# EAGLE design tv_b_gone_extended_schematic (EAGLE 8.5.0)
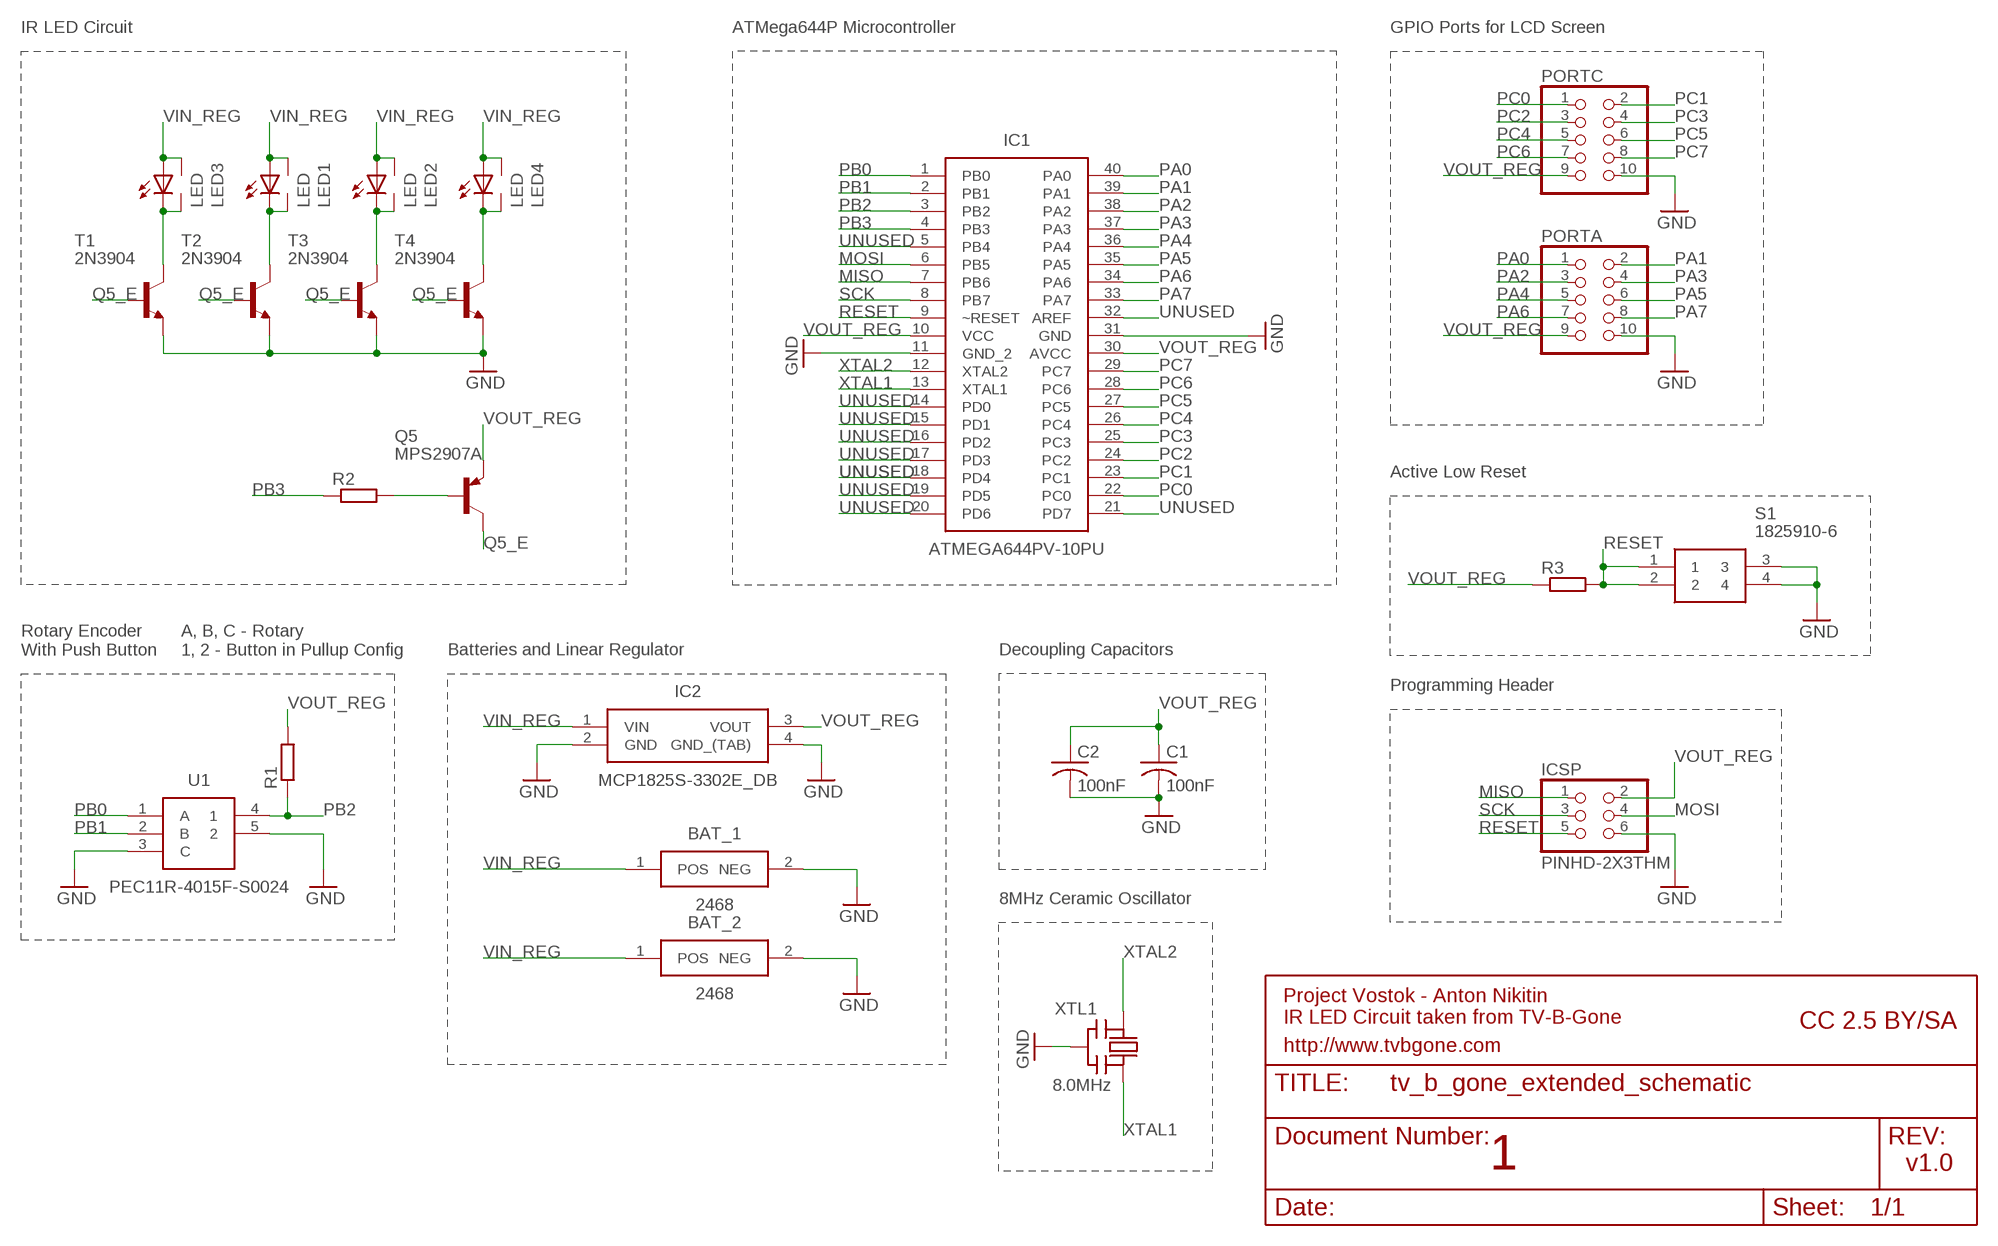
[diagram p0: schematic, sheet 1]

## Parts
BAT_1  2468  [2468]
BAT_2  2468  [2468]
C1  100nF  C-US025-025X050  [C025-025X050]
C2  100nF  C-US025-025X050  [C025-025X050]
IC1  ATMEGA644PV-10PU  [DIP254P1524X483-40]
IC2  MCP1825S-3302E_DB  [SOT230P700X180-4N]
ICSP  PINHD-2X3THM  [ISP6]
LED1  LED  [5MM-SIDE]
LED2  LED  [5MM-SIDE]
LED3  LED  [5MM-SIDE]
LED4  LED  [5MM-SIDE]
PORTA  PINHD-2X5  [2X05]
PORTC  PINHD-2X5  [2X05]
Q5  MPS2907A  [TO92-CBE]
R1  R-EU_0204/5  [0204/5]
R2  R-EU_0204/5  [0204/5]
R3  R-EU_0204/7  [0204/7]
S1  1825910-6  [1825910-6]
T1  2N3904  [TO92]
T2  2N3904  [TO92]
T3  2N3904  [TO92]
T4  2N3904  [TO92]
U1  PEC11R-4015F-S0024  [PEC12R-4XXXF-SXXXX_1]
XTL1  8.0MHz  CERMOSCILL  [CERM_OSC]

## Nets
GND: BAT_1.2(NEG) BAT_2.2(NEG) C1.2 C2.2 IC1.11(GND_2) IC1.31(GND) IC2.2(GND) IC2.4(GND_(TAB)) ICSP.6 PORTA.10 PORTC.10 S1.3 S1.4 T1.3(E) T2.3(E) T3.3(E) T4.3(E) U1.3(C) U1.5 XTL1.P$2(GND)
MISO: IC1.7(PB6) ICSP.1
MOSI: IC1.6(PB5) ICSP.4
N$7: Q5.B R2.2
N$10: IC1.5(PB4)
N$11: IC1.14(PD0)
N$12: IC1.15(PD1)
N$13: IC1.16(PD2)
N$14: IC1.17(PD3)
N$15: IC1.18(PD4)
N$16: IC1.19(PD5)
N$17: IC1.20(PD6)
N$18: IC1.32(AREF)
N$19: IC1.21(PD7)
PA0: IC1.40(PA0) PORTA.1
PA1: IC1.39(PA1) PORTA.2
PA2: IC1.38(PA2) PORTA.3
PA3: IC1.37(PA3) PORTA.4
PA4: IC1.36(PA4) PORTA.5
PA5: IC1.35(PA5) PORTA.6
PA6: IC1.34(PA6) PORTA.7
PA7: IC1.33(PA7) PORTA.8
PB0: IC1.1(PB0) U1.1(A)
PB1: IC1.2(PB1) U1.2(B)
PB2: IC1.3(PB2) R1.1 U1.4
PB3: IC1.4(PB3) R2.1
PC0: IC1.22(PC0) PORTC.1
PC1: IC1.23(PC1) PORTC.2
PC2: IC1.24(PC2) PORTC.3
PC3: IC1.25(PC3) PORTC.4
PC4: IC1.26(PC4) PORTC.5
PC5: IC1.27(PC5) PORTC.6
PC6: IC1.28(PC6) PORTC.7
PC7: IC1.29(PC7) PORTC.8
Q5_E: Q5.C T1.2(B) T2.2(B) T3.2(B) T4.2(B)
RESET: IC1.9(~RESET) ICSP.5 R3.2 S1.1 S1.2
SCK: IC1.8(PB7) ICSP.3
T1_C: LED3.K2(C1) LED3.K(C) T1.1(C)
T2_C: LED1.K2(C1) LED1.K(C) T2.1(C)
T3_C: LED2.K2(C1) LED2.K(C) T3.1(C)
T4_C: LED4.K2(C1) LED4.K(C) T4.1(C)
VIN_REG: BAT_1.1(POS) BAT_2.1(POS) IC2.1(VIN) LED1.A LED1.A2(A1) LED2.A LED2.A2(A1) LED3.A LED3.A2(A1) LED4.A LED4.A2(A1)
VOUT_REG: C1.1 C2.1 IC1.10(VCC) IC1.30(AVCC) IC2.3(VOUT) ICSP.2 PORTA.9 PORTC.9 Q5.E R1.2 R3.1
XTAL1: IC1.13(XTAL1) XTL1.P$3(OUT)
XTAL2: IC1.12(XTAL2) XTL1.P$1(IN)

## Notes on the sheet
- IR LED Circuit | ATMega644P Microcontroller | GPIO Ports for LCD Screen
- PC0 | PC1
- PC2 | PC3
- PC4 | PC5
- PC6 | PC7
- PB0 | PA0 | VOUT_REG
- PB1 | PA1
- PB2 | PA2
- PB3 | PA3
- UNUSED | PA4
- MOSI | PA5 | PA0 | PA1
- MISO | PA6 | PA2 | PA3
- SCK | PA7 | PA4 | PA5
- RESET | UNUSED | PA6 | PA7
- VOUT_REG | VOUT_REG
- VOUT_REG
- XTAL2 | PC7
- XTAL1 | PC6
- UNUSED | PC5
- UNUSED | PC4
- UNUSED | PC3
- UNUSED | PC2
- UNUSED | UNUSED | PC1 | Active Low Reset
- UNUSED | PC0
- UNUSED | UNUSED
- Rotary Encoder
  With Push Button
- A, B, C - Rotary
  1, 2 - Button in Pullup Config
- Batteries and Linear Regulator | Decoupling Capacitors
- Programming Header
- 8MHz Ceramic Oscillator
- Project Vostok - Anton Nikitin
  IR LED Circuit taken from TV-B-Gone
- CC 2.5 BY/SA
- http://www.tvbgone.com
- 1 | v1.0

## Library data of the parts
BAT_1 BAT_2 = SamacSys_Parts:2468: Cylindrical Battery Contacts, Clips, Holders & Springs 2AAA PC MNT HOLDER <https://componentsearchengine.com/Images/1/2468.jpg> Source: Datasheet <http://docs-europe.electrocomponents.com/webdocs/002e/0900766b8002ef75.pdf>; ALLIED_NUMBER: 70182756; DESCRIPTION: Cylindrical Battery Contacts, Clips, Holders & Springs 2AAA PC MNT HOLDER; HEIGHT: mm; MANUFACTURER_NAME: Keystone Electronics; MANUFACTURER_PART_NUMBER: 2468; RS_PART_NUMBER: 2794965; SUPPLIER_NAME: RS
C1 C2 = rcl-ez:C-US: CAPACITOR, American symbol
IC1 = SamacSys_Parts:ATMEGA644PV-10PU: 8-bit Microcontroller with In-System Programmable Flash <https://componentsearchengine.com/Images/1/ATMEGA644PV-10PU.jpg> Source: Datasheet <http://componentsearchengine.com/Datasheets/1/ATMEGA644PV-10PU.pdf>; DESCRIPTION: 8-bit Microcontroller with In-System Programmable Flash; HEIGHT: mm; MANUFACTURER_NAME: Microchip; MANUFACTURER_PART_NUMBER: ATMEGA644PV-10PU; RS_PART_NUMBER: 7380491P; SUPPLIER_NAME: RS
IC2 = SamacSys_Parts:MCP1825S-3302E_DB: LDO Regulator 500mA 3.3V SOT223-3 Microchip MCP1825S-3302E/DB, LDO Voltage Regulator, 0.5A, 3.3 V 0.5%, 2.1 6 Vin, 4-Pin SOT-223 <https://componentsearchengine.com/Images/3/MCP1825S-3302E_DB.jpg> Source: Datasheet <http://docs-europe.electrocomponents.com/webdocs/137e/0900766b8137ed40.pdf>; ALLIED_NUMBER: 70046538; DESCRIPTION: LDO Regulator 500mA 3.3V SOT223-3 Microchip MCP1825S-3302E/DB, LDO Voltage Regulator, 0.5A, 3.3 V 0.5%, 2.1 6 Vin, 4-Pin SOT-223; HEIGHT: 1.8mm; MANUFACTURER_NAME: Microchip; MANUFACTURER_PART_NUMBER: MCP1825S-3302E/DB; RS_PART_NUMBER: 9115520; SUPPLIER_NAME: RS
ICSP = adaprog:PINHD-2X3
LED1-LED4 = tvbgone:LED
PORTA PORTC = pinhead:PINHD-2X5: PIN HEADER
Q5 = transistor-pnp:MPS2907*: PNP Transistror
R1 R2 = resistor:R-EU_: RESISTOR, European symbol
R3 = rcl:R-EU_: RESISTOR, European symbol; SPICEPREFIX: R
S1 = SamacSys_Parts:1825910-6: TE CONNECTIVITY / ALCOSWITCH - 1825910-6 - TACT SWITCH, SPST, 0.05A, 24VDC, SOLDER Source: Datasheet <http://www.farnell.com/datasheets/921681.pdf>; DESCRIPTION: TE CONNECTIVITY / ALCOSWITCH - 1825910-6 - TACT SWITCH, SPST, 0.05A, 24VDC, SOLDER; HEIGHT: mm; MANUFACTURER_NAME: TE Connectivity; MANUFACTURER_PART_NUMBER: 1825910-6; RS_PART_NUMBER: 1613779; SUPPLIER_NAME: RS
T1-T4 = transistor:2N3904: NPN TRANSISTOR
U1 = SamacSys_Parts:PEC11R-4015F-S0024: Bourns 24 Pulse Incremental Mechanical Rotary Encoder with a 6 mm Flat Shaft (Not Indexed), Through Hole <https://componentsearchengine.com/Images/3/PEC11R-4015F-S0024.jpg> Source: Datasheet <https://www.bourns.com/docs/Product-Datasheets/pec11R.pdf>; DESCRIPTION: Bourns 24 Pulse Incremental Mechanical Rotary Encoder with a 6 mm Flat Shaft (Not Indexed), Through Hole; HEIGHT: mm; MANUFACTURER_NAME: Bourns; MANUFACTURER_PART_NUMBER: PEC11R-4015F-S0024; RS_PART_NUMBER: 7377739P; SUPPLIER_NAME: RS
XTL1 = digg:CERMOSCILL

## Board
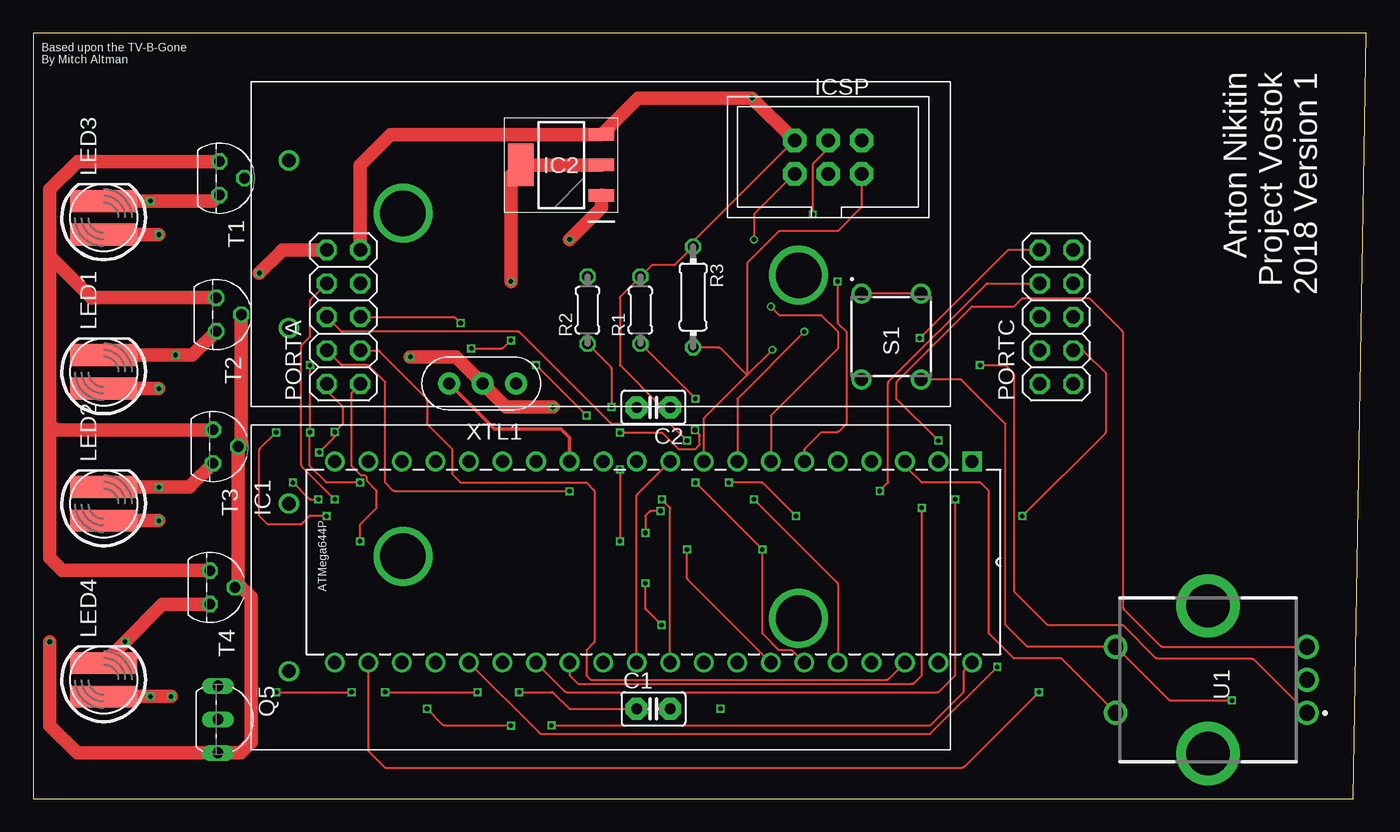
[diagram p1: board, top side]
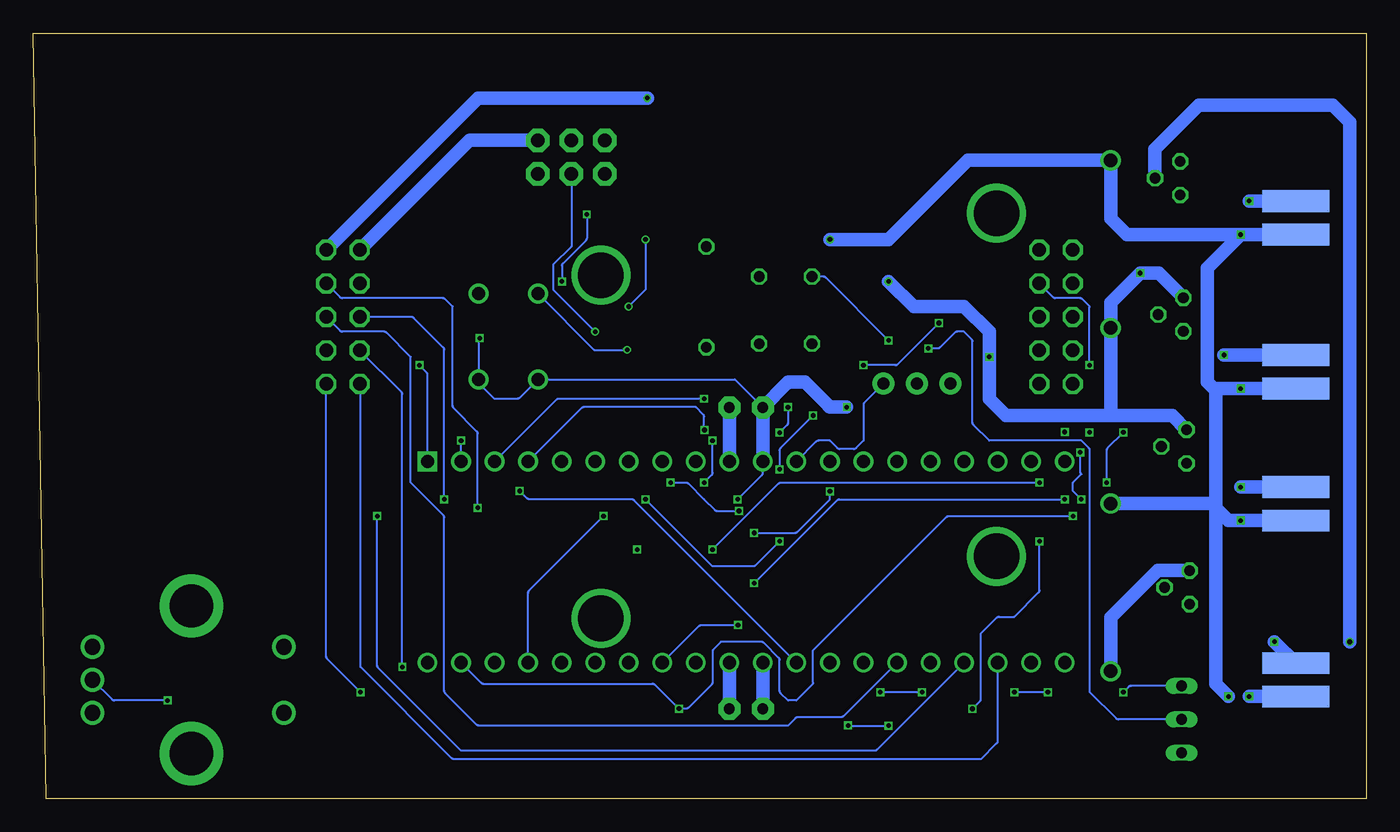
[diagram p2: board, bottom side, seen from below]

Size 101 x 58 mm. Coordinates in mm from the lower left corner, seen from the top.
Outline: 0,0 100,0 101,58 0,58 0,0
Copper layers (1*16): Top 0.035559375mm / dielectric 1.6mm / Bottom 0.035559375mm
Design rules "oshpark-2layer": minimum track width 6mil, minimum drill 10mil, track to track 6mil, track to pad 6mil, pad to pad 6mil, via to via 6mil, smd to smd 6mil, copper to edge 15mil, drill to drill 6mil, minimum pad ring 5mil, minimum via ring 5mil, stop-mask expansion 2.5mil, vias tented up to drill 0mil, thermal gap 10mil

### Footprints (pad centres in the part's own frame; a part is rotated, then mirrored left to right if it is on the bottom)
2468 = drill 1.02 pad 1.53: 1 23.625,-6.35; 2 23.625,6.35 | drill 3.45 pad 3.45: 3 -14.985,2.35; 4 14.985,-2.35
C025-025X050 = drill 0.813 pad 1.676 octagon: 1 -1.27,0; 2 1.27,0
DIP254P1524X483-40 = drill 0.991 pad 1.486 square: 1 -15.24,48.26 | drill 0.991 pad 1.486: 2 -15.24,45.72; 3 -15.24,43.18; 4 -15.24,40.64; 5 -15.24,38.1; 6 -15.24,35.56; 7 -15.24,33.02; 8 -15.24,30.48; 9 -15.24,27.94; 10 -15.24,25.4; 11 -15.24,22.86; 12 -15.24,20.32; 13 -15.24,17.78; 14 -15.24,15.24; 15 -15.24,12.7; 16 -15.24,10.16; 17 -15.24,7.62; 18 -15.24,5.08; 19 -15.24,2.54; 20 -15.24,0; 21 0,0; 22 0,2.54; 23 0,5.08; 24 0,7.62; 25 0,10.16; 26 0,12.7; 27 0,15.24; 28 0,17.78; 29 0,20.32; 30 0,22.86; 31 0,25.4; 32 0,27.94; 33 0,30.48; 34 0,33.02; 35 0,35.56; 36 0,38.1; 37 0,40.64; 38 0,43.18; 39 0,45.72; 40 0,48.26
SOT230P700X180-4N = smd 1.95 x 0.95: 1 -3.05,2.3; 2 -3.05,0; 3 -3.05,-2.3 | smd 1.95 x 3.2: 4 3.05,0
ISP6 = drill 1.016 pad 1.778 octagon: 1 -2.54,-1.27; 2 -2.54,1.27; 3 0,-1.27; 4 0,1.27; 5 2.54,-1.27; 6 2.54,1.27
5MM-SIDE = smd 1.651 x 5.08: A -1.27,0; K 1.27,0 | smd 1.651 x 5.08 bottom: A2 -1.27,0; K2 1.27,0
2X05 = drill 1.016 octagon: 1 -5.08,-1.27; 2 -5.08,1.27; 3 -2.54,-1.27; 4 -2.54,1.27; 5 0,-1.27; 6 0,1.27; 7 2.54,-1.27; 8 2.54,1.27; 9 5.08,-1.27; 10 5.08,1.27
TO92-CBE = drill 0.813 long: B 0,0; C 2.54,0; E -2.54,0
0204/5 = drill 0.813 octagon: 1 -2.54,0; 2 2.54,0
0204/7 = drill 0.813 octagon: 1 -3.81,0; 2 3.81,0
1825910-6 = drill 1 pad 1.5: 1 3.25,2.25; 2 3.25,-2.25; 3 -3.25,2.25; 4 -3.25,-2.25
TO92 = drill 0.813 octagon: 1 1.27,0; 2 0,1.905; 3 -1.27,0
PEC12R-4XXXF-SXXXX_1 = drill 1.2 pad 1.8: 1 -2.5,-7.5; 2 2.5,-7.5; 3 0,-7.5; 4 -2.5,7; 5 2.5,7 | drill 3.28 pad 4.8: 6 5.6,0; 7 -5.6,0
CERM_OSC = drill 0.9 pad 1.676: P$1 -2.54,0; P$2 0,0; P$3 2.54,0

### Placement (x,y rotation side)
BAT_1  43,42 180 top
BAT_2  43,16 180 top
C1  46.99,6.79 0 top
C2  46.99,29.63 180 top
IC1  22.86,10.3 270 top
IC2  40,48 180 top
ICSP  60.22,48.6 0 top
LED1  5.35,32.33 90 top
LED2  5.35,22.33 90 top
LED3  5.35,44 90 top
LED4  5.35,9 90 top
PORTA  23.52,36.49 90 top
PORTC  77.52,36.49 90 top
Q5  14,6 270 top
R1  46,37 90 top
R2  42,37 90 top
R3  50,38 270 top
S1  65,35 90 top
T1  14.11,47 270 top
T2  13.87,36.67 270 top
T3  13.63,26.67 270 top
T4  13.39,16 270 top
U1  89,9 90 top
XTL1  34.05,31.45 180 top

### Tracks (layer width: path | path; a pad name or v marks a point on that pad's centre or on a via)
GND  (via drill 0.35)
  Top 0.152: S1.4 70.3,31.75 73.66,28.38 73.66,13.14 75.31,11.5 U1.5 86,7.5 arc45 86.17,7.43 v90.81,7.43 | IC1.31 48.26,21.93 arc45 48.19,22.11 v47.62,22.67 | PORTC.10 73.96,41.57 arc45 73.78,41.5 v67.16,34.88
  Top 1.016: T1.3 3.38,48.27 1.27,46.16 1.27,41.09 | 1.27,41.09 4.45,37.91 4.47,37.94 T2.3 | T3.3 1.72,27.94 1.27,28.38 | 1.27,28.38 1.27,41.09 | T4.3 2.23,17.27 1.27,18.23 1.27,28.38 | IC2.2 IC2.4 36.2,47.24 v36.2,39.18 | PORTA.10 19,41.57 arc45 18.83,41.5 v17.14,39.81 | v28.57,33.47 31.93,33.47 arc-45 32.11,33.39 XTL1.P$2 35.77,29.73 arc45 35.95,29.66 v39.37,29.66
  Bottom 0.152: C2.2 45.73,29.65 47.84,31.75 S1.3 64.14,30.36 arc45 64.31,30.29 66.04,30.29 67.18,31.43 arc45 67.25,31.6 S1.4 67.25,34.69 arc45 67.18,34.87 v67.16,34.88 | v47.62,22.67 45.79,24.5 arc-45 45.72,24.68 IC1.11 | v90.81,7.43 94.83,7.43 arc45 95,7.5 U1.3
  Bottom 1.016: C1.2 IC1.31 | C2.2 IC1.11 | 19.68,29.02 19.38,29.33 BAT_1.2 19.38,37.59 v17.14,39.81 15.74,39.81 T2.3 | 19.68,29.02 27.3,29.02 28.57,30.29 v28.57,33.47 28.57,35.37 30.48,37.27 34.29,37.27 v36.2,39.18 | T3.3 14.71,29.02 19.68,29.02 | T4.3 15.82,17.27 19.38,13.72 BAT_2.2 | PORTC.10 68.02,49.8 arc45 67.84,49.87 ICSP.6 | v39.37,29.66 40.53,29.66 arc45 40.71,29.73 42.55,31.56 43.71,31.56 arc-45 43.89,31.49 45.73,29.65
MISO  (via drill 0.35)
  Top 0.152: ICSP.1 54.61,44.26 v54.61,42.35 | v55.88,37.27 56.52,36.64 59.69,36.64 60.96,35.37 60.96,34.1 55.88,29.02 IC1.7
  Bottom 0.152: v54.61,42.35 54.61,38.55 v55.88,37.27
MOSI  (via drill 0.35)
  Top 0.152: ICSP.4 60.22,49.34 arc-45 60.15,49.16 59.05,48.07 v59.05,44.26 | v60.94,39.18 60.94,36.13 arc45 61.01,35.95 61.59,35.37 61.59,28.38 61.03,27.82 arc-45 60.85,27.75 59.69,27.75 58.49,26.55 arc45 58.42,26.38 IC1.6
  Bottom 0.152: v59.05,44.26 59.05,42.46 arc45 59.13,42.28 60.87,40.55 arc-45 60.94,40.37 v60.94,39.18
N$7  (via drill 0.35)
  Top 0.152: v33.2,34.1 35.48,34.1 arc45 35.66,34.17 v36.2,34.71
  Bottom 0.152: Q5.B 18.79,6 arc45 18.96,6.07 20.95,8.06 20.95,26.38 arc-45 21.03,26.55 21.59,27.11 28.57,27.11 29.77,28.31 arc45 29.84,28.49 29.84,34.63 arc-45 29.92,34.81 30.48,35.37 31.01,35.37 arc-45 31.19,35.3 32.31,34.17 arc45 32.49,34.1 v33.2,34.1 | v36.2,34.71 40.95,39.47 arc-45 41.13,39.54 R2.2
PA0  (via drill 0.35)
  Top 0.152: IC1.40 70.56,9.74 arc45 70.48,9.56 70.48,8.06 67.94,5.53 39.32,5.53 arc-45 v39.27,5.55 | v36.2,5.53 31.22,5.53 arc-45 31.04,5.6 v29.84,6.79 | v24.77,19.5 24.77,20.66 arc-45 24.84,20.84 26.04,22.04 26.04,23.2 arc45 25.96,23.38 25.3,24.04 25.3,24.34 25.16,24.47 24.87,24.47 24.13,25.21 24.13,30.65 arc-45 24.2,30.82 PORTA.1
  Bottom 0.152: v39.27,5.55 arc-45 39.22,5.53 v36.2,5.53 | v29.84,6.79 29.28,7.36 arc-45 29.21,7.54 29.21,12.51 28.01,13.71 arc45 27.84,13.78 26.67,13.78 24.84,15.61 arc-45 24.77,15.79 v24.77,19.5
PA1  (via drill 0.35)
  Top 0.152: v22.23,21.4 20.95,21.4 20.39,20.84 arc-45 20.21,20.77 17.89,20.77 arc-45 17.71,20.84 17.14,21.4 17.14,26.38 arc-45 17.22,26.55 v18.41,27.75 | PORTA.2 22.25,31.01 arc45 22.32,30.83 23.5,29.66 23.5,28.51 arc-45 23.42,28.33 v22.86,27.77 22.86,27.52 arc-45 22.79,27.34 v21.68,26.23 | v19.68,23.94 20.88,22.74 arc45 21.06,22.67 v21.61,22.67
  Bottom 0.152: IC1.39 67.05,8.77 arc-45 66.88,8.7 54.08,8.7 arc45 53.9,8.63 52.1,6.83 arc-45 v52.07,6.82 51.52,6.82 arc-45 51.34,6.89 49.6,8.63 arc-45 49.53,8.8 49.53,11.13 arc45 49.46,11.31 48.9,11.88 45.83,11.88 arc45 45.65,11.8 44.52,10.68 arc45 44.45,10.5 44.45,8.17 arc-45 44.38,7.99 43.81,7.43 43.18,7.43 41.98,8.63 arc-45 41.91,8.8 41.91,11.24 31.82,21.33 arc45 31.64,21.4 v22.23,21.4 | v18.41,27.75 19.61,26.55 arc-45 19.68,26.38 v19.68,23.94 | v21.61,22.67 arc-45 21.62,22.7 22.23,23.3 22.23,23.94 21.59,24.57 21.61,24.6 arc45 21.68,24.77 v21.68,26.23
PA2
  Top 0.152: PORTA.3 26.08,33.95 arc-45 26.26,33.88 29.77,30.36 arc-45 29.84,30.19 29.84,28.38 31.75,26.48 31.75,24.57 32.31,24.01 arc45 32.49,23.94 41.91,23.94 42.47,23.38 arc-45 42.55,23.2 42.55,11.98 arc-45 42.47,11.8 41.91,11.24 41.91,9.34 42.24,9.01 64.64,9.01 arc45 64.82,9.08 IC1.38
PA3  (via drill 0.35)
  Top 0.152: v57.78,21.4 55.32,23.87 arc45 55.14,23.94 v52.7,23.94 | v47.53,21.79 46.85,21.79 arc45 46.67,21.71 46.35,21.4 arc-45 46.38,21.35 v46.38,20.13 | v40.64,23.28 27.43,23.28 arc-45 27.25,23.36 26.67,23.94 26.67,31.56 25.47,32.76 arc45 25.3,32.83 23.48,32.83 arc-45 23.3,32.9 PORTA.4
  Bottom 0.152: IC1.37 63.5,15.58 arc45 63.43,15.76 v57.78,21.4 | v52.7,23.94 51.54,23.94 arc45 51.36,23.87 50.16,22.67 49.36,21.86 arc-45 49.18,21.79 v47.53,21.79 | v46.38,20.13 43.28,20.13 arc-45 43.11,20.2 40.64,22.67 v40.64,23.28
PA4  (via drill 0.35)
  Top 0.152: PORTA.5 31.82,36.49 arc-45 32,36.42 v32.38,36.03 | v44.45,24.94 v44.45,19.5 | IC1.36 60.96,16.21 arc45 60.89,16.39 v54.61,22.67 | v41.91,29.02 v38.1,32.83
  Bottom 0.152: v32.38,36.03 35.51,32.9 arc45 35.69,32.83 v38.1,32.83 | v44.45,24.94 44.45,26.38 arc45 44.38,26.55 v41.91,29.02 | v44.45,19.5 46.28,17.66 arc45 46.46,17.59 49.53,17.59 v54.61,22.67
PA5  (via drill 0.35)
  Top 0.152: v50.16,23.94 v55.24,18.86 55.24,12.51 56.52,11.24 57.38,11.24 arc-45 57.55,11.17 IC1.35 | v49.53,27.11 48.33,28.31 arc45 48.16,28.38 43.81,28.38 36.9,35.3 arc45 36.73,35.37 23.48,35.37 arc-45 23.3,35.44 PORTA.6
  Bottom 0.152: v50.16,23.94 49.6,24.5 arc-45 49.53,24.68 v49.53,27.11
PA6  (via drill 0.35)
  Top 0.152: IC1.34 49.6,16.58 arc-45 49.53,16.75 v49.53,18.86 | v24.77,23.94 22.33,23.94 arc-45 22.15,24.01 20.95,25.21 20.95,27.7 arc-45 v20.98,27.75 v20.98,32.83
  Bottom 0.152: v49.53,18.86 44.52,23.87 arc45 44.34,23.94 v24.77,23.94 | v20.98,32.83 20.98,37.23 arc45 20.95,37.27 21.52,37.84 arc-45 21.7,37.91 23.57,37.91 arc45 23.74,37.98 PORTA.7
PA7  (via drill 0.35)
  Top 0.152: v47.6,13.14 46.45,14.3 arc-45 46.38,14.48 v46.38,16.32 | v22.86,22.67 20.39,25.14 arc-45 20.32,25.32 20.32,34.22 arc-45 20.39,34.39 21,35 21,37.67 arc-45 21.07,37.85 PORTA.8
  Bottom 0.152: IC1.33 50.57,13.07 arc45 50.39,13.14 v47.6,13.14 | v46.38,16.32 40.1,22.6 arc45 39.92,22.67 v22.86,22.67
PB0  (via drill 0.35)
  Top 0.152: v71.73,32.83 73.66,32.83 74.22,32.27 arc-45 74.3,32.09 74.3,15.79 arc45 74.37,15.61 76.83,13.14 82.55,13.14 85.02,10.68 arc45 85.19,10.61 92.29,10.61 arc-45 92.47,10.53 U1.1
  Bottom 0.152: IC1.1 71.12,32.11 arc-45 71.19,32.29 v71.73,32.83
PB1  (via drill 0.35)
  Top 0.152: v68.58,27.11 65.41,30.29 65.41,31.45 arc-45 65.48,31.63 71.12,37.27 74.3,37.27 74.93,37.91 80.01,37.91 82.48,35.44 arc-45 82.55,35.27 82.55,14.52 arc45 82.62,14.34 85.39,11.57 arc45 85.57,11.5 U1.2
  Bottom 0.152: IC1.2 v68.58,27.11
PB2  (via drill 0.35)
  Top 0.152: U1.4 77.89,10.61 74.3,10.61 72.39,12.51 72.39,23.3 71.75,23.94 67.31,23.94 66.04,25.21 IC1.3 | R1.1 v50.16,30.3 arc-45 v50.16,30.29
  Bottom 0.152: v50.16,30.29 61.19,30.29 arc-45 61.36,30.22 IC1.3
PB3  (via drill 0.35)
  Top 0.152: R2.1 43.74,32.72 arc-45 43.81,32.54 v43.81,29.66 | v44.45,27.73 47.54,27.73 arc-45 47.72,27.66 48.9,26.48 50.16,26.48 50.49,26.81 50.49,27.47 arc45 50.42,27.65 v50.14,27.92
  Bottom 0.152: v43.81,29.66 43.81,28.47 arc45 43.89,28.29 v44.45,27.73 | v50.14,27.92 arc45 50.16,27.97 50.16,28.91 arc-45 50.24,29.09 50.8,29.66 59.28,29.66 arc-45 59.46,29.58 IC1.4
PC0  (via drill 0.35)
  Top 0.152: IC1.22 25.4,3.72 arc45 25.47,3.55 26.67,2.35 70.38,2.35 arc45 70.56,2.42 v76.2,8.06
  Bottom 0.152: v76.2,8.06 78.72,10.58 arc45 78.79,10.76 PORTC.1
PC1
  Bottom 0.152: IC1.23 27.94,4.36 arc45 28.01,4.18 29.21,2.99 69.11,2.99 arc45 69.29,3.06 76.2,9.97 76.2,31.29 arc-45 PORTC.2
PC2  (via drill 0.35)
  Top 0.152: v74.93,21.4 81.21,27.68 arc45 81.28,27.86 81.28,32.2 79.6,33.88 arc45 79.42,33.95 PORTC.3
  Bottom 0.152: IC1.24 37.09,3.69 arc45 37.27,3.62 68.58,3.62 74.86,9.9 arc45 74.93,10.07 v74.93,21.4
PC3  (via drill 0.35)
  Top 0.152: IC1.25 38.36,4.96 arc45 38.53,4.89 67.94,4.89 v73.03,9.97
  Bottom 0.152: v73.03,9.97 73.03,30.62 arc-45 73.1,30.8 PORTC.4
PC4
  Bottom 0.152: IC1.26 39.63,6.23 arc45 39.8,6.16 43.08,6.16 arc-45 43.25,6.09 43.81,5.53 67.2,5.53 arc45 67.38,5.6 69.78,7.99 arc45 69.85,8.17 69.85,21.3 arc-45 69.92,21.47 72.39,23.94 72.39,33.47 74.22,35.3 arc-45 74.4,35.37 77.56,35.37 arc45 77.74,35.44 PORTC.5
PC5  (via drill 0.35)
  Top 0.152: IC1.27 40.26,8.14 arc45 40.44,8.06 68.47,8.06 arc45 68.65,8.14 69.85,9.34 v69.85,22.67
  Bottom 0.152: v69.85,22.67 69.85,33.99 arc-45 69.92,34.17 72.17,36.42 arc-45 72.34,36.49 PORTC.6
PC6  (via drill 0.35)
  Top 0.152: IC1.28 40.64,9.44 arc45 40.71,9.26 41.27,8.7 66.57,8.7 arc45 66.75,8.77 67.31,9.34 v67.31,22.04
  Bottom 0.152: v67.31,22.04 67.31,27.64 arc-45 67.38,27.82 69.14,29.58 arc45 69.22,29.76 69.22,37.27 69.78,37.84 arc-45 69.95,37.91 77.56,37.91 arc45 77.74,37.98 PORTC.7
PC7  (via drill 0.35)
  Top 0.152: v64.14,23.3 64.7,23.87 arc45 64.77,24.05 64.77,31.45 arc-45 64.84,31.63 72.17,38.96 arc-45 72.34,39.03 PORTC.8
  Bottom 0.152: IC1.29 55.48,22.6 arc-45 55.66,22.67 63.4,22.67 arc45 63.57,22.74 v64.14,23.3
Q5_E  (via drill 0.35)
  Top 1.016: T2.2 15.78,26.91 T3.2 15.54,16.24 | 15.54,16.24 T4.2 | 15.54,16.24 16.51,15.27 16.51,4.26 15.71,3.46 Q5.C 3.33,3.46 1.27,5.53 v1.27,11.88
  Bottom 1.016: v1.27,11.88 1.27,51.24 2.54,52.52 12.7,52.52 16.02,49.2 T1.2
RESET  (via drill 0.35)
  Top 0.152: v56,34 54.09,32.09 | 54.09,32.09 50.8,28.8 IC1.9 | S1.2 S1.1 | ICSP.5 62.76,44.79 60.96,42.99 56.52,42.99 54.09,40.56 54.09,32.09 | R3.2 51.88,34.19 arc-45 52.05,34.12 54.09,32.09
  Bottom 0.152: S1.1 58.5,34 v56,34
SCK  (via drill 0.35)
  Top 0.152: v58.42,35.37 53.34,30.29 IC1.8
  Bottom 0.152: ICSP.3 60.22,41.83 61.59,40.45 61.59,38.55 v58.42,35.37
T1_C  (via drill 0.35)
  Top 1.016: LED3.K2 v8.89,45.27 13.54,45.27 arc45 13.72,45.34 T1.1
  Bottom 1.016: LED3.K2 v8.89,45.27
T2_C  (via drill 0.35)
  Top 1.016: LED1.K2 v10.79,33.6 11.96,33.6 arc45 12.14,33.67 T2.1
  Bottom 1.016: LED1.K2 v10.79,33.6
T3_C  (via drill 0.35)
  Top 1.016: LED2.K2 v9.53,23.6 11.72,23.6 arc45 11.9,23.67 T3.1
  Bottom 1.016: LED2.K2 v9.53,23.6
T4_C  (via drill 0.35)
  Top 1.016: LED4.K2 v6.97,11.89 9.74,14.66 arc-45 9.91,14.73 T4.1
  Bottom 1.016: LED4.K2 v6.97,11.89
VIN_REG  (via drill 0.35)
  Top 1.016: LED4.A2 v8.89,7.73 v10.46,7.73 | LED2.A2 v9.53,21.06 | LED1.A2 v9.53,31.06 | LED3.A2 v9.53,42.73 | v40.64,42.35 43.05,44.77 IC2.1
  Bottom 1.016: LED3.A2 v9.53,42.73 | v9.53,42.73 18.16,42.73 19.38,43.95 BAT_1.1 30.2,48.35 36.2,42.35 v40.64,42.35 | LED1.A2 v9.53,31.06 11.56,31.06 | 11.56,31.06 12.06,31.56 12.06,40.19 v9.53,42.73 | LED2.A2 v9.53,21.06 10.46,21.06 11.43,22.04 | 11.43,22.04 11.43,30.92 11.56,31.06 | v10.46,7.73 11.43,8.7 11.43,22.04 | BAT_2.1 11.74,22.35 11.43,22.04 | LED4.A2 v8.89,7.73
VOUT_REG  (via drill 0.35)
  Top 0.152: v18.41,8.06 v24.13,8.06 | v26.67,8.06 v33.66,8.06 | v36.83,8.06 39.27,8.06 arc-45 39.44,7.99 40.64,6.79 C1.1 | IC1.30 45.72,22.89 arc-45 45.79,23.07 IC1.10 | ICSP.2 50.07,42.26 arc45 50,42.09 R3.1 48.64,40.45 46.91,40.45 R1.2 44.51,38.05 arc45 44.45,37.91 44.45,32.83 47.57,29.71 arc45 47.75,29.63 C2.1
  Top 1.016: PORTA.9 24.79,47.99 27.1,50.3 IC2.3 45.83,53.08 v54.47,53.08 ICSP.2
  Bottom 0.152: Q5.E 17.84,8.54 arc-45 18.01,8.47 v18.41,8.06 | v24.13,8.06 v26.67,8.06 | v33.66,8.06 v36.83,8.06
  Bottom 1.016: C1.1 IC1.30 | C2.1 IC1.10 | v54.47,53.08 67.18,53.08 arc-45 67.36,53 PORTC.9
XTAL1
  Top 0.254: XTL1.P$3 34.96,28 40,28 40.64,27.36 IC1.13
XTAL2
  Bottom 0.152: XTL1.P$1 38.03,30.01 arc-45 38.1,29.84 38.1,27.11 38.66,26.55 arc45 38.84,26.48 39.9,26.48 arc45 40.08,26.55 40.64,27.11 41.5,27.11 arc-45 41.68,27.04 IC1.12

### Text on the board
tNames: Based upon the TV-B-Gone / By Mitch Altman | Anton Nikitin / Project Vostok / 2018 Version 1 | ATMega644P